# Altium project SL6996.PrjPcb
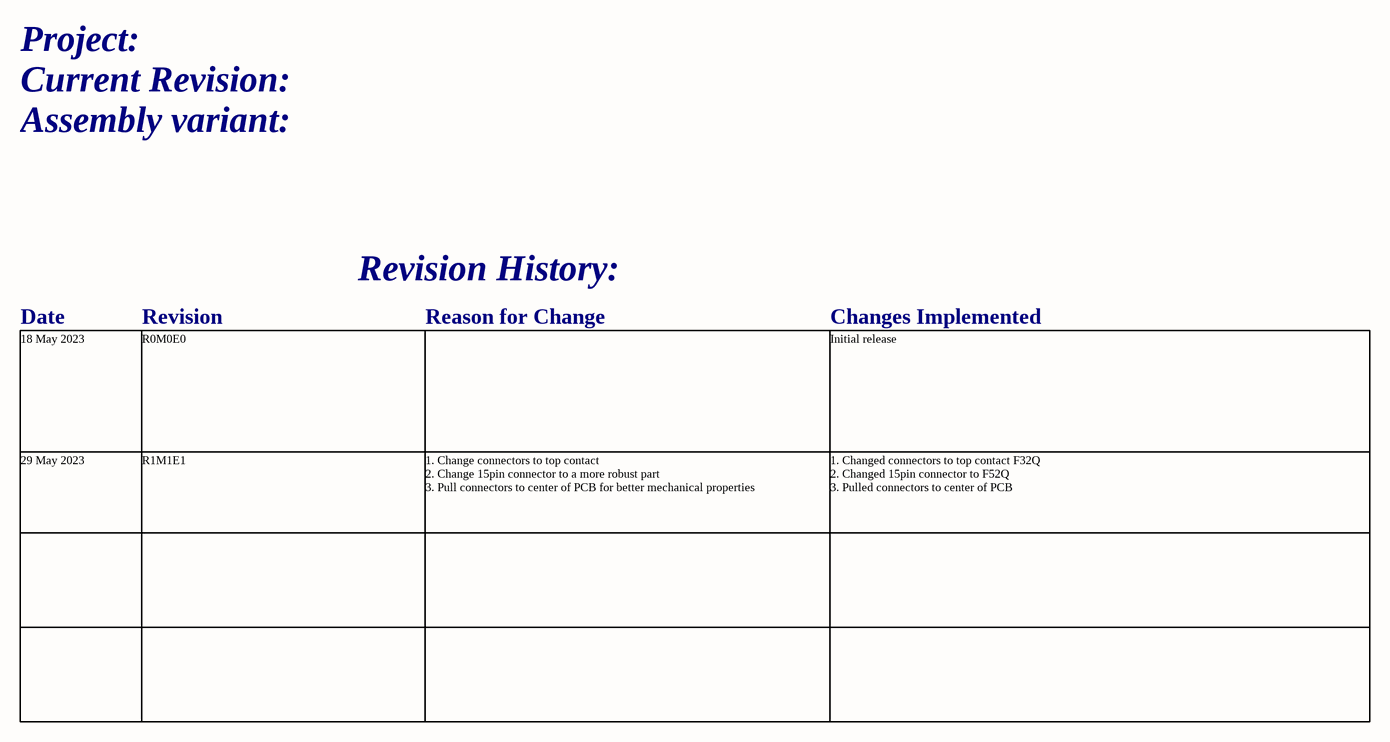
[diagram p0: Project_information.SchDoc]
document_number: D2088000; drawn_by: Samo Laznik; project_title: SL6996; revision: R1M1E1
2 sheets, 10 parts. Net scope: flat (ports and power ports of the same name join across sheets).
Board file: SL6996.PcbDoc
Sheets:
  Project_information.SchDoc
  Connectors.SchDoc

## Sheet Project_information.SchDoc: =project_title
size Tabloid; ENG_APP_DATE: --/--/--; DSN_APP_DATE: --/--/--; CHK_APP_DATE: --/--/--; CompanyName: Luxonis Holding; DrawnBy: Samo Laznik; Organization: Luxonis Holding; Address1: 1925 Harmony Park Drive; Address2: Westminster, CO; Address3: 80234; Address4: United States; DocumentNumber: D2088000; Revision: R1M1E1; SheetNumber: 1; SheetTotal: 2

### Notes on the sheet
- Project:
- Current Revision:
- Assembly variant:
- Revision History:
- Date
- Revision
- Reason for Change
- Changes Implemented
- 18 May 2023
- R0M0E0
- Initial release
- 29 May 2023
- R1M1E1
- 1. Change connectors to top contact
  2. Change 15pin connector to a more robust part
  3. Pull connectors to center of PCB for better mechanical properties
- 1. Changed connectors to top contact F32Q
  2. Changed 15pin connector to F52Q
  3. Pulled connectors to center of PCB
- Title
- Size:
- Date:
- Tabloid
- Number:
- Time:
- Revision:
- Sheet
- of
- Drawn by:

## Sheet Connectors.SchDoc: =project_title
size Tabloid; ENG_APP_DATE: --/--/--; DSN_APP_DATE: --/--/--; CHK_APP_DATE: --/--/--; CompanyName: Luxonis Holding; DrawnBy: Samo Laznik; Organization: Luxonis Holding; Address1: 1925 Harmony Park Drive; Address2: Westminster, CO; Address3: 80234; Address4: United States; DocumentNumber: D2088000; Revision: R1M1E1; SheetNumber: 2; SheetTotal: 2
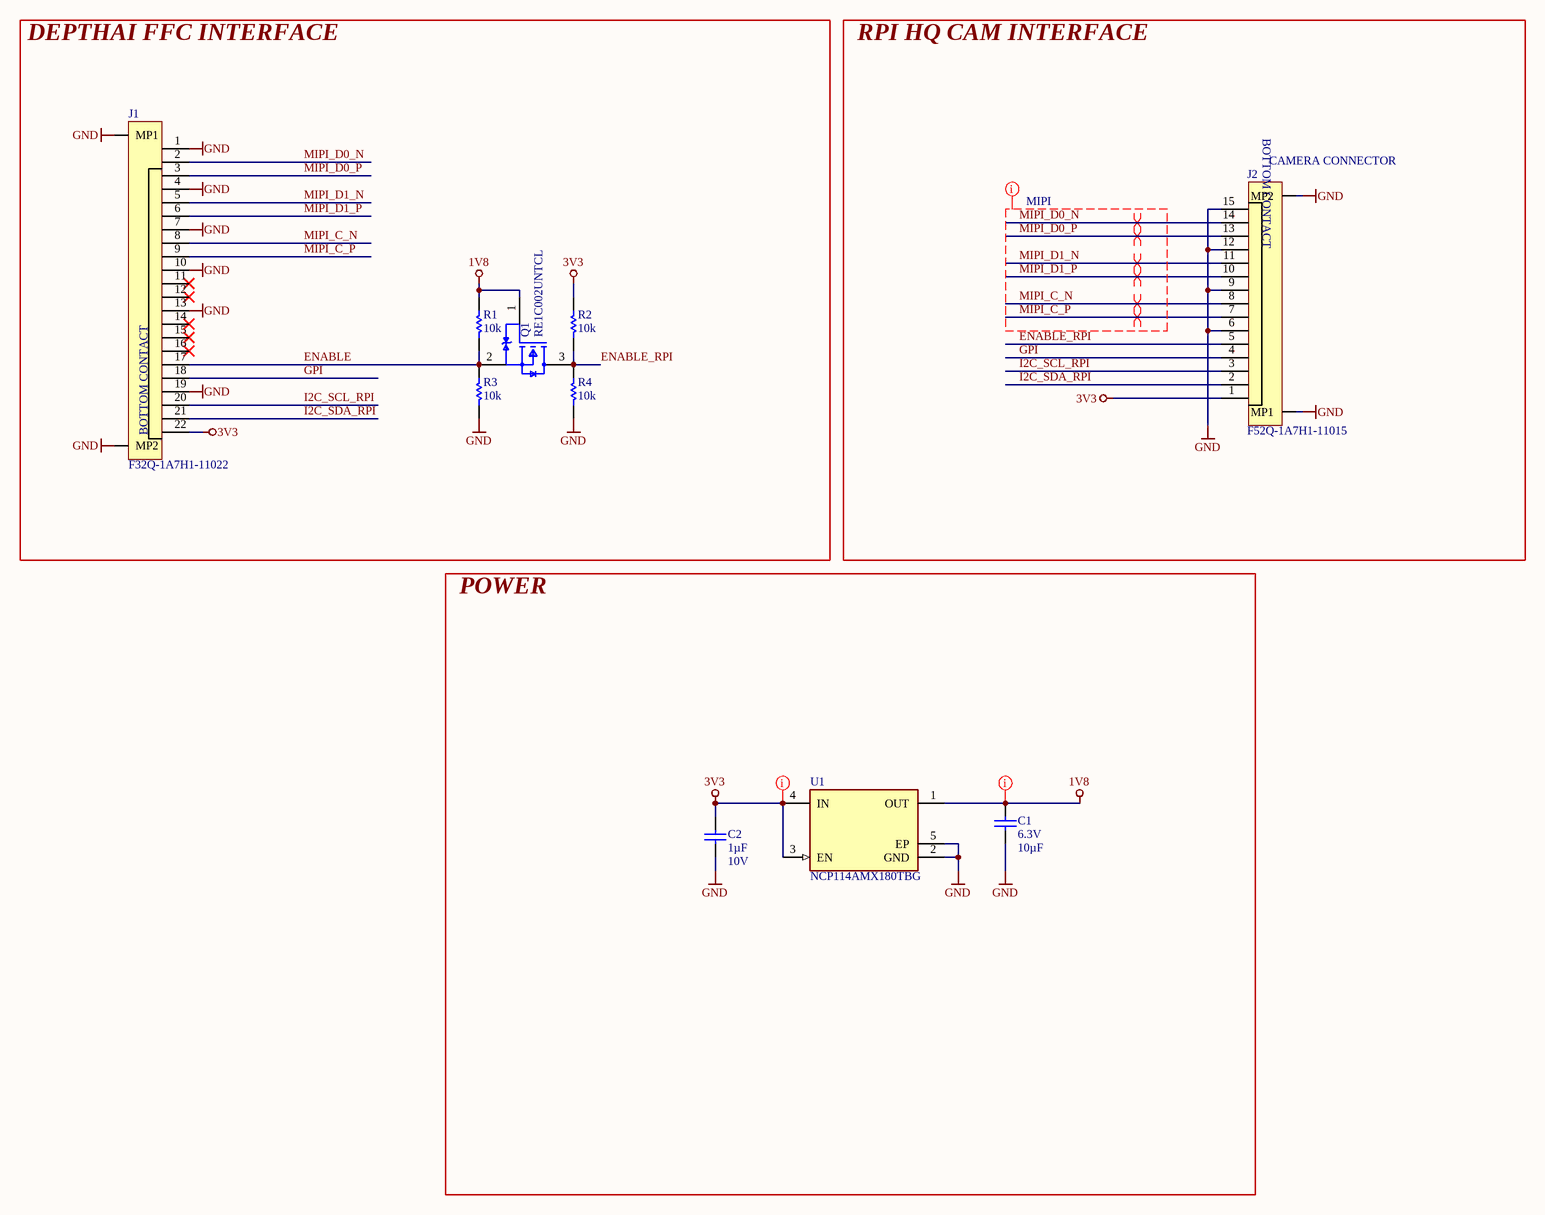
[diagram p1: Connectors.SchDoc]

### Parts
C1  value 10µF  Voltage Rating: 6.3V  [CAPC0402(1005)70_L]  (hidden comment: GRM155R60J106ME15D)
C2  value 1µF  Voltage Rating: 10V  [CAPC0201(0603)33_L]  (hidden comment: GRM033R61A105ME15D)
J1  F32Q-1A7H1-11022  [F32Q-1A7H1-11022]
J2  F52Q-1A7H1-11015  [F52Q-1A7H1-11015-Footprint-1]
Q1  RE1C002UNTCL  [RE1C002UNTCL]
R1  value 10k  [RESC0402(1005)_L]  (hidden comment: RC0402FR-1310KL)
R2  value 10k  [RESC0402(1005)_L]  (hidden comment: RC0402FR-1310KL)
R3  value 10k  [RESC0402(1005)_L]  (hidden comment: RC0402FR-1310KL)
R4  value 10k  [RESC0402(1005)_L]  (hidden comment: RC0402FR-1310KL)
U1  NCP114AMX180TBG  [FP-517CU-MFG]

### Blocks framed on the sheet
DEPTHAI FFC INTERFACE: J1 Q1 R1-R4
RPI HQ CAM INTERFACE: J2
POWER: C1 C2 U1

### Nets
1V8: C1.2 Q1.1(Gate) R1.2 U1.1(OUT)
3V3: C2.2 J1.22 J2.1 R2.2 U1.3(EN) U1.4(IN)
GND: C1.1 C2.1 J1.1 J1.4 J1.7 J1.10 J1.13 J1.19 J1.MP1 J1.MP2 J2.6 J2.9 J2.12 J2.15 J2.MP1 J2.MP2 R3.1 R4.1 U1.2(GND) U1.5(EP)
ENABLE: J1.17 Q1.2(Source) R1.1 R3.2
ENABLE_RPI: J2.5 Q1.3(Drain) R2.1 R4.2
GPI: J1.18 J2.4
I2C_SCL_RPI: J1.20 J2.3
I2C_SDA_RPI: J1.21 J2.2
MIPI_C_N: J1.8 J2.8
MIPI_C_P: J1.9 J2.7
MIPI_D0_N: J1.2 J2.14
MIPI_D0_P: J1.3 J2.13
MIPI_D1_N: J1.5 J2.11
MIPI_D1_P: J1.6 J2.10

Not connected (* = marked no-connect by the designer): J1 11* 12* 14* 15* 16*

### Layout directives
net class MIPI; rule Matched Net Lengths [Delay Tolerance = 1ps]; rule Matched Net Lengths [Delay Tolerance = 0,5ps]: MIPI_C_N, MIPI_C_P, MIPI_D0_N, MIPI_D0_P, MIPI_D1_N, MIPI_D1_P
differential pair; differential pair class 100ohm: MIPI_C_N, MIPI_C_P, MIPI_D0_N, MIPI_D0_P, MIPI_D1_N, MIPI_D1_P
net class Power_trace: 1V8, 3V3

### Notes on the sheet
- (near J2) CAMERA CONNECTOR
- Title
- Size:
- Date:
- Tabloid
- Number:
- Time:
- Revision:
- Sheet
- of
- Drawn by:
- (in symbol CMP-002-00189-2) BOTTOM CONTACT
- (in symbol CMP-002-00195-1) BOTTOM CONTACT

### Library data of the parts
C1 = CMP-004-000009-5: CAP CER 10UF 6.3V X5R 0402 20%; Manufacturer 1: Murata; Manufacturer Part Number 1: GRM155R60J106ME15D; Case/Package: 0402; Min Operating Temperature: -55°C; Max Operating Temperature: 85°C; Dielectric: X5R; Length: 0.039inch; Width: 0.02inch; ComponentLink1URL: https://www.murata.com/~/media/webrenewal/support/library/catalog/products/capacitor/mlcc/c02e.ashx?la=en-us&src-supplier=Digi-Key; ComponentLink1Description: https://www.murata.com/~/media/webrenewal/support/library/catalog/products/capacitor/mlcc/c02e.ashx?la=en-us&src-supplier=Digi-Key; Tolerance: 20%; Mounting Technology: SMT; Design Item ID: GRM155R60J106ME15D
C2 = CMP-004-000026-6: CAP CER 1UF 10V X5R 0201 20%; Manufacturer 1: Murata; Capacitor Type: Ceramic; ComponentLink1Description: https://psearch.en.murata.com:443/capacitor/product/GRM033R61A105ME15%23.pdf?src-supplier=IHS+Markit; Design Item ID: GRM033R61A105ME15D; Dielectric: X5R; Max Operating Temperature: 85°C; Case/Package: 0201; Manufacturer Part Number 1: GRM033R61A105ME15D; Tolerance: 20%; Mounting Technology: SMT; ComponentLink1URL: https://psearch.en.murata.com:443/capacitor/product/GRM033R61A105ME15%23.pdf?src-supplier=IHS+Markit; ComponentLink2URL: http://search.murata.co.jp/Ceramy/image/img/A01X/G101/ENG/GRM033R61A105ME15-01.pdf?src-supplier=Digi-Key; Min Operating Temperature: -55°C; ComponentLink2Description: http://search.murata.co.jp/Ceramy/image/img/A01X/G101/ENG/GRM033R61A105ME15-01.pdf?src-supplier=Digi-Key
J1 = CMP-002-00195-1: FPC/FFC Connector Socket 22 Position 0.5mm Top Contact Solder Right Angle Surface Mount T/R; Manufacturer 1: Amphenol ICC / FCI; Pitch: 0.02inch; Voltage Rating: 50V; Max Operating Temperature: 105°C; Mount: Surface Mount; Manufacturer Part Number 1: F32Q-1A7H1-11022; Pins: 22; System: connector; Min Operating Temperature: -40°C
J2 = CMP-002-00189-2: FPC/FFC Connector Socket 15 Position 1mm Top Contact Solder Right Angle Surface Mount T/R; Manufacturer 1: Amphenol; System: connector; Manufacturer Part Number 1: F52Q-1A7H1-11015; Pins: 15
Q1 = CMP-120-000001-2: MOSFET N-CH 20V 0.2A EMT3; Manufacturer 1: Rohm; Continuous Drain Current: 200mA; Case/Package: SOT-89; Manufacturer Part Number 1: RE1C002UNTCL; Design Item ID: RE1C002UNTCL; Max Drain to Source Voltage: 20V
R1-R4 = CMP-115-000004-8: RES SMD 10K OHM 1% 1/16W 0402; Manufacturer 1: Yageo; Power Rating: 62.5mW; Temperature Coefficient: 100ppm/°C; Voltage Rating: 50V; Tolerance: 1%; Max Operating Temperature: 155°C; Case/Package: 0402; Manufacturer Part Number 1: RC0402FR-1310KL; Min Operating Temperature: -55°C; Design Item ID: RC0402FR-1310KL
U1 = CMP-00047-1: LDO Voltage Regulators 300 MA CMOS LDO AD O; Manufacturer 1: onsemi; Max Output Current: 300mA; Output Voltage: 1.8V; Min Supply Voltage: 1.7V; Max Supply Voltage: 5.5V; Max Operating Temperature: 85°C; Min Operating Temperature: -40°C; Vfb/Vout: 1.8V; Pins: 5; Case/Package: UDFN-4; Manufacturer Part Number 1: NCP114AMX180TBG

## Assembly variants
Production: not fitted R3 R3 R4 R?